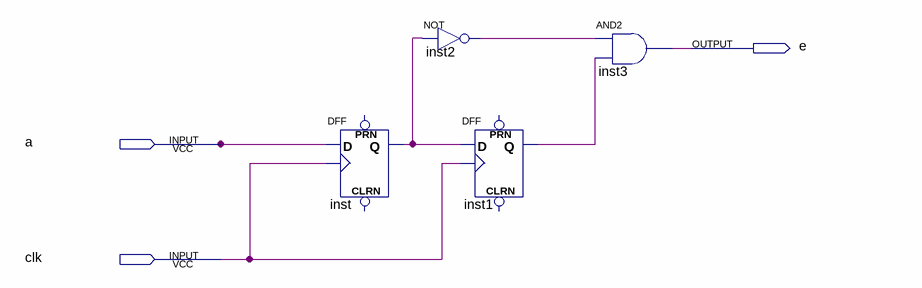
[diagram p0: schematic sheet]
// Quartus schematic test4.bdf as structural Verilog: 4 symbols, 3 pins
module test4 (
  input  a,
  input  clk,
  output e
);

  wire inst1_q, inst2_out, inst_q;

  DFF inst (.CLK(clk), .D(a), .Q(inst_q));  // open: CLRN, PRN
  not inst2 (inst2_out, inst_q);
  DFF inst1 (.CLK(clk), .D(inst_q), .Q(inst1_q));  // open: CLRN, PRN
  and inst3 (e, inst2_out, inst1_q);
endmodule
